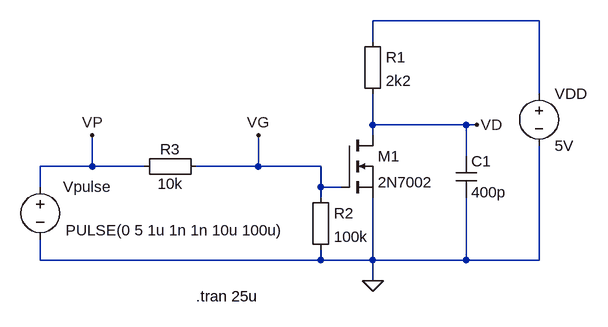
[diagram p0: schematic inverter_nmos.asc]
inverter_nmos.asc, the LTspice schematic file:
Version 4
SHEET 1 880 680
WIRE 496 -80 240 -80
WIRE 240 -48 240 -80
WIRE 496 32 496 -80
WIRE 240 80 240 32
WIRE 384 80 240 80
WIRE 400 80 384 80
WIRE 240 96 240 80
WIRE 384 128 384 80
WIRE -192 144 -192 96
WIRE -192 144 -272 144
WIRE -112 144 -192 144
WIRE 64 144 64 96
WIRE 64 144 -32 144
WIRE 160 144 64 144
WIRE -272 176 -272 144
WIRE 160 176 160 144
WIRE 192 176 160 176
WIRE 160 192 160 176
WIRE -272 288 -272 256
WIRE 160 288 160 272
WIRE 160 288 -272 288
WIRE 240 288 240 192
WIRE 240 288 160 288
WIRE 384 288 384 192
WIRE 384 288 240 288
WIRE 496 288 496 112
WIRE 496 288 384 288
WIRE 240 320 240 288
FLAG 240 320 0
FLAG 400 80 VD
FLAG 64 96 VG
FLAG -192 96 VP
SYMBOL Misc\\EuropeanResistor 224 -64 R0
SYMATTR InstName R1
SYMATTR Value 2k2
SYMBOL voltage -272 160 R0
WINDOW 0 35 15 Left 2
WINDOW 3 39 82 Left 2
WINDOW 123 0 0 Left 2
WINDOW 39 0 0 Left 2
SYMATTR InstName Vpulse
SYMATTR Value PULSE(0 5 1u 1n 1n 10u 100u)
SYMBOL voltage 496 16 R0
SYMATTR InstName VDD
SYMATTR Value 5V
SYMBOL nmos 192 96 R0
SYMATTR InstName M1
SYMATTR Value 2N7002
SYMBOL Misc\\EuropeanCap 368 128 R0
SYMATTR InstName C1
SYMATTR Value 400p
SYMBOL Misc\\EuropeanResistor 144 176 R0
SYMATTR InstName R2
SYMATTR Value 100k
SYMBOL Misc\\EuropeanResistor -16 128 R90
WINDOW 0 5 56 VBottom 2
WINDOW 3 27 56 VTop 2
SYMATTR InstName R3
SYMATTR Value 10k
TEXT -32 344 Left 2 !.tran 25u

The netlist it stands for:
* inverter_nmos.asc
R1 N001 VD 2k2
Vpulse VP 0 PULSE(0 5 1u 1n 1n 10u 100u)
VDD N001 0 5V
M1 VD VG 0 0 2N7002
C1 VD 0 400p
R2 VG 0 100k
R3 VG VP 10k
.model NMOS NMOS
.model PMOS PMOS
.lib standard.mos
.tran 25u
.backanno
.end